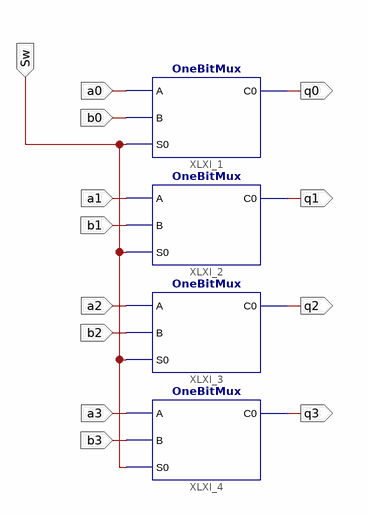
[diagram p0: schematic sheet 1]
// Xilinx ISE schematic EightBitMux.sch (spartan3e) as structural Verilog: 4 symbols, 13 ports
module EightBitMux (
  input  a0,
  input  b0,
  input  a1,
  input  b1,
  input  a2,
  input  b2,
  input  a3,
  input  b3,
  input  Sw,
  output q3,
  output q2,
  output q1,
  output q0
);

  OneBitMux XLXI_1 (.A(a0), .B(b0), .S0(Sw), .C0(q0));
  OneBitMux XLXI_2 (.A(a1), .B(b1), .S0(Sw), .C0(q1));
  OneBitMux XLXI_3 (.A(a2), .B(b2), .S0(Sw), .C0(q2));
  OneBitMux XLXI_4 (.A(a3), .B(b3), .S0(Sw), .C0(q3));
endmodule
